# Altium project pcb-sensor-AD5933_2.PrjPcb
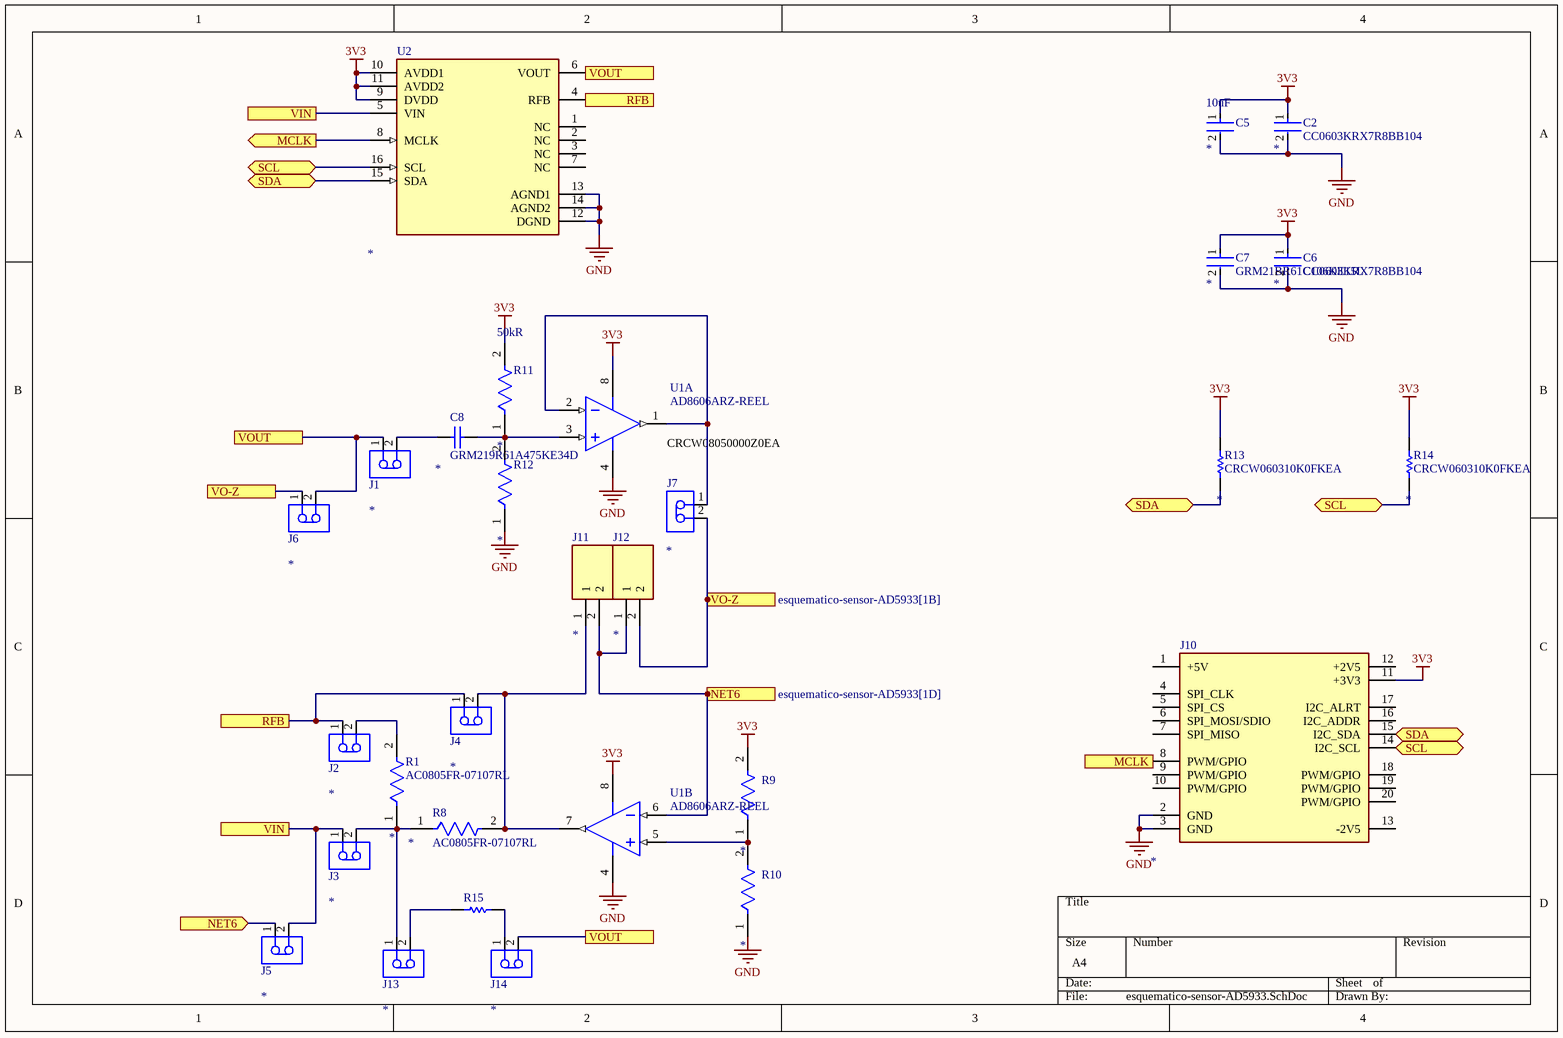
[diagram p0: esquematico-sensor-AD5933.SchDoc]
1 sheet, 28 parts. Net scope: flat (ports and power ports of the same name join across sheets).
Board file: pcb-sensor-AD5933.PcbDoc

## Sheet esquematico-sensor-AD5933.SchDoc
size A4; SheetNumber: 1; SheetTotal: 1

### Parts
C2  CC0603KRX7R8BB104  [FP-CC0603-DA-MFG]
C5  Capacitance: 10uF  [FP-GRM21B-0_1-IPC_C]  (hidden comment: GRM21BR61C106KE15L)
C6  CC0603KRX7R8BB104  [FP-CC0603-DA-MFG]
C7  GRM21BR61C106KE15L  [FP-GRM21B-0_1-IPC_C]
C8  GRM219R61A475KE34D  [CAPC2013X95X45LL10T25]
J1  (no value)  [TECO-640456-2_V]
J2  (no value)  [TECO-640456-2_V]
J3  (no value)  [TECO-640456-2_V]
J4  (no value)  [TECO-640456-2_V]
J5  (no value)  [TECO-640456-2_V]
J6  (no value)  [TECO-640456-2_V]
J7  (no value)  [TECO-640456-2_V]
J10  10129382-920002BLF  [Base Board Modular Connector (MALE)]  (value not drawn)
J11  (no value)  [Terminal Block 2-position]
J12  TB0011-350-02BE  [Terminal Block 2-position]  (value not drawn)
J13  (no value)  [TECO-640456-2_V]
J14  (no value)  [TECO-640456-2_V]
R1  AC0805FR-07107RL  [FP-AC0805-MFG]
R8  AC0805FR-07107RL  [FP-AC0805-MFG]
R9  (no value)  [FP-TNPU0603-e3-MFG]
R10  (no value)  [FP-TNPU0603-e3-MFG]
R11  Resistance: 50kR  [FP-TNPU0603-e3-MFG]
R12  (no value)  [FP-TNPU0603-e3-MFG]
R13  CRCW060310K0FKEA  [RESC1609X50X30NL8T20]
R14  CRCW060310K0FKEA  [RESC1609X50X30NL8T20]
R15  CRCW08050000Z0EA  [RESC2013X50X30LL20T20]  (value not drawn)
U1  AD8606ARZ-REEL  [ADI-R-8_L]  (parts A,B of 2)
U2  AD5933WYRSZ-REEL7  [FP-RS-16-IPC_A]  (value not drawn)

### Ports
MCLK (in, see esquematico-sensor-AD5933[1A]), MCLK (out, see esquematico-sensor-AD5933[3C]), NET6 (in, see esquematico-sensor-AD5933[2C]), NET6 (out, see esquematico-sensor-AD5933[1D]), RFB (see esquematico-sensor-AD5933[1C]), RFB (see esquematico-sensor-AD5933[2A]), SCL (bidir, see esquematico-sensor-AD5933[1A], esquematico-sensor-AD5933[4B]), SCL (bidir, see esquematico-sensor-AD5933[1A], esquematico-sensor-AD5933[4C]), SCL (bidir, see esquematico-sensor-AD5933[4B], esquematico-sensor-AD5933[4C]), SDA (bidir, see esquematico-sensor-AD5933[1A], esquematico-sensor-AD5933[3B]), SDA (bidir, see esquematico-sensor-AD5933[1A], esquematico-sensor-AD5933[4C]), SDA (bidir, see esquematico-sensor-AD5933[3B], esquematico-sensor-AD5933[4C]), VIN (see esquematico-sensor-AD5933[1A]), VIN (see esquematico-sensor-AD5933[1D]), VO-Z (see esquematico-sensor-AD5933[1B]), VO-Z (see esquematico-sensor-AD5933[2C]), VOUT (see esquematico-sensor-AD5933[1B], esquematico-sensor-AD5933[2A]), VOUT (see esquematico-sensor-AD5933[1B], esquematico-sensor-AD5933[2D]), VOUT (see esquematico-sensor-AD5933[2A], esquematico-sensor-AD5933[2D])

### Nets
3V3: C2.1 C5.1 C6.1 C7.1 J10.11(+3V3) R9.2 R11.2 R13.1 R14.2 U1.8(+V) U2.9(DVDD) U2.10(AVDD1) U2.11(AVDD2)
GND: C2.2 C5.2 C6.2 C7.2 J10.2(GND) J10.3(GND) R10.1 R12.1 U1.4(-V) U2.12(DGND) U2.13(AGND1) U2.14(AGND2)
NetC8_1: C8.1 J1.2
NetC8_2: C8.2 R11.1 R12.2 U1.3(+IN_A)
NetJ1_1: J1.1 J6.2 J14.2 U2.6(VOUT) ; port VOUT
NetJ2_1: J2.1 J4.1 U2.4(RFB) ; port RFB
NetJ2_2: J2.2 R1.2
NetJ3_1: J3.1 J5.2 U2.5(VIN) ; port VIN
NetJ3_2: J3.2 J13.1 R1.1 R8.1
NetJ4_2: J4.2 J11.1 R8.2 U1.7(OUT_B)
NetJ5_1: J5.1 J11.2 J12.1 U1.6(-IN_B) ; port NET6
NetJ6_1: J6.1 J7.2 J12.2 ; port VO-Z
NetJ7_1: J7.1 U1.1(OUT_A) U1.2(-IN_A)
NetJ10_8: J10.8(PWM/GPIO) U2.8(MCLK) ; port MCLK
NetJ10_14: J10.14(I2C_SCL) R14.1 U2.16(SCL) ; port SCL
NetJ10_15: J10.15(I2C_SDA) R13.2 U2.15(SDA) ; port SDA
NetJ13_2: J13.2 R15.1
NetJ14_1: J14.1 R15.2
NetR9_1: R9.1 R10.2 U1.5(+IN_B)

Not connected (* = marked no-connect by the designer): J10 1(+5V) 4(SPI_CLK) 5(SPI_CS) 6(SPI_MOSI/SDIO) 7(SPI_MISO) 9(PWM/GPIO) 10(PWM/GPIO) 12(+2V5) 13(-2V5) 16(I2C_ADDR) 17(I2C_ALRT) 18(PWM/GPIO) 19(PWM/GPIO) 20(PWM/GPIO); U2 1(NC) 2(NC) 3(NC) 7(NC)

### Notes on the sheet
- (near U1) CRCW08050000Z0EA

### Library data of the parts
C2 C6 = CMP-03422-000234-1: CAP CER 0.1UF 25V X7R 0603; Manufacturer: YAGEO; Capacitance: 100 nF; Tolerance: 0.1; Temperature Coefficient: 15%; Material: Ceramic; Value: 100 nF; Category: Cap; ComponentLink2URL: http://www.yageo.com/documents/recent/UPY-GPHC_X7R_6.3V-to-50V_18.pdf; Voltage Rating: 25 V; ComponentLink2Description: Datasheet; RoHS: TRUE; Octopart: https://octopart.com/cc0603krx7r8bb104-yageo-8376534; Manufacturer Part Number: CC0603KRX7R8BB104; Mouser Description: CC Series 0603 0.1 uF 25 V ±10% Tolerance X7R SMT Multilayer Ceramic Capacitor; Device Class L2: Capacitors; Automotive: No; Temperature Range Low: -55°C; Lead Free: Yes; Temperature Range High: +125°C; Package: CC0603-DA; Temperature: -55°C to +125°C; Footprint Url: http://www.yageo.com/exep/pages/download/literatures/UPY-C_GEN_24.pdf; Height: 0.9mm; Voltage: 25 V; Temperature Characteristic: X7R; Device Class L3: Ceramic Capacitors; Digikey Description: CAP CER 0.1UF 25V X7R 0603; Device Class L1: Passive Components; Parameter 1: *
C5 C7 = CMP-2007-03453-2: Chip Multilayer Ceramic Capacitors for General Purpose, 0805, 10uF, X5R, 15%, 10%, 16V; Radiation Hardening: No; Thickness: 0.053inch; Voltage Rating (DC): 16V; Lead Free: Lead Free; Package Quantity: 1; Width: 1.25mm; Case Code (Imperial): 0805; Depth: 1.25mm; Packaging: Tape and Reel; Dielectric: X5R; Max Operating Temperature: 85°C; Tolerance: 10%; Voltage Rating: 16V; Voltage: 16V; Height: 1.25mm; Case Code (Metric): 2012; Material: Ceramic; Mount: Surface Mount; Case/Package: 0805; REACH SVHC: No SVHC; Length: 2mm; Min Operating Temperature: -55°C; Termination: SMD/SMT; Parameter 1: *
  C7: Capacitance: 10uF
C8 = CMP-2007-00178-1: Manufacturer: Murata; Part Number: GRM219R61A475KE34D; Parameter 1: *
J1-J7 J13 J14 = CMP-2000-05417-1: Male Header, Pitch 2.54 mm, 1 x 2 Position, Height 10.49 mm, Tail Length 3.556 mm, -55 to 105 degC, RoHS, Bulk; Manufacturer: TE Connectivity; Standards: RoHSCompliant,ELVCompliant,UL94V-0; Material, Housing: Polyester; Agency Approvals: CSA,UL; Brand/Series: MTA-100Series; Contact Centerline Spacing: 0.100 / in.; Material, Contact: CopperAlloy; Current, Rating: 5 / A; Color, Housing: White; Contact Termination Area Plating: Tin; Special Features: Pinstrip; Number of Positions: 2; Pin Spacing: 0.1 / "; Temperature, Operating: -55to+105 / degC; Angle: Straight; Mount Angle: Vertical; Connector Type: MTA-100; Primary Type: InterconnectSystem; Voltage, Rating: 250 / V; Mounting Hole Size: 0.04 / "; Number of Rows: 1; Termination: Solder; Length, Terminal Post: 0.14 / in.; Manufacturer URL: http://www.te.com/; Color: White; Size, Post: 0.025 / in.; Contact Shape: Square; Mounting Type: PCMount; Datasheet URL: https://datasheet.ciiva.com/11746/0900766b80eb7fdd-11746365.pdf; Type: PCBPlug; Datasheet Version: Rev. W, 06/2004; Number of Contacts: 2; Flammability Rating: UL94V-0; Contact Plating: Tin; Length, Pin: 0.14 / "; Contact Mating Area Plating: Tin; Length, Overall: 0.2 / "; Parameter 1: *
J10 = Base Board Modular Connector (MALE): Parameter 1: *
J11 J12 = TB0011-350-02BE: Fixed Terminal Blocks 2 Poles, Screw Type, Horizontal, 3.50 Pitch, 24-18 (AWG), Blue, Terminal Block Connector; Supplier 1: DigiKey; Supplier Part Number 1: 2223-TB0011-350-02BE-ND; Supplier 2: Mouser; Supplier Part Number 2: 179-TB0011-350-02BE; Supplier 3: Farnell; Supplier Part Number 3: TB0011-350-02BE; Parameter 1: *
R1 R8 = CMP-03412-037308-1: Res SMD 107 Ohm 1% 1/8W 0805; Manufacturer: Yageo; Tolerance: 0.01; Value: 107Ω; Automotive Grade: Grade 0; Voltage Rating: 150V; Height: 0.6mm; Device Class L2: Resistors; ComponentLink2Description: Datasheet; Series: AC; Octopart: https://octopart.com/ac0805fr-07107rl-yageo-71367522; Digikey Description: Res SMD 107 Ohm 1% 1/8W 0805; Composition: Thick Film; ComponentLink2URL: http://www.yageo.com/documents/recent/PYu-AC_51_RoHS_L_6.pdf; Ipc Land Pattern Name: RESC200125X50; Category: Res; Temperature Range High: +155°C; Automotive: Yes; Manufacturer Part Number: AC0805FR-07107RL; Footprint Url: http://www.yageo.com/exep/pages/download/literatures/PYu-R_Mount_10.pdf; Device Class L1: Passive Components; RoHS: TRUE; Lead Free: Yes; Resistance: 107Ω; Temperature: -55°C to +155°C; Device Class L3: Chip SMD Resistors; Power Rating: 1/8W; Temperature Range Low: -55°C; Package: AC0805; Parameter 1: *
R9 R10 R12 = CMP-02407-013067-1: RES SMD 50K OHM 0.02% 1/10W 0603; Temperature Coefficient: 5ppm/°C; Max Power Dissipation: 100mW; Resistance: 50kR; Max Operating Temperature: 125°C; Min Operating Temperature: -55°C; Case Code (Metric): 1608; Features: Moisture Resistant; Resistor Type: Thin Film; Packaging: Cut Tape; Case/Package: 0603; Tolerance: 0.02%; Number of Terminations: 2; Case Code (Imperial): 0603; Parameter 1: *
R11 = CMP-02407-013067-1: RES SMD 50K OHM 0.02% 1/10W 0603; Temperature Coefficient: 5ppm/°C; Max Power Dissipation: 100mW; Max Operating Temperature: 125°C; Min Operating Temperature: -55°C; Case Code (Metric): 1608; Features: Moisture Resistant; Resistor Type: Thin Film; Packaging: Cut Tape; Case/Package: 0603; Tolerance: 0.02%; Number of Terminations: 2; Case Code (Imperial): 0603; Parameter 1: *
R13 R14 = CMP-1666-00005-4: Chip Resistor, 10 KOhm, +/- 1%, 100 mW, -55 to 155 degC, 0603 (1608 Metric), RoHS, Tape and Reel; Manufacturer: Vishay Semiconductor; Voltage Rating: 75 V; Max Operating Temperature: 155 degC; PackageDescription: 2-Pin Surface Mount Device, Body 1.575 x 0.85 mm; ComponentLink1Description: Manufacturer URL; RoHSCompliant: true; PackageReference: 0603; REACH SVHC: Unknown; Length: 1.55 mm; DatasheetVersion: 06/2012; Packaging: Tape and Reel; Min Operating Temperature: -55 degC; Mounting Technology: Surface Mount; ComponentLink2URL: https://datasheet.ciiva.com/11809/0900766b80d98afc-11809037.pdf; Height: 0.45 mm; ComponentLink2Description: Datasheet; Package Quantity: 5000; ComponentLink1URL: http://www.vishay.com/; Parameter 1: *
R15 = CMP-2001-04896-1: Manufacturer: Vishay Dale; Part Number: CRCW08050000Z0EA
U1 = CMP-0384-01320-2: Double Channel Wide Bandwidth Operational Amplifier, 10 MHz BW, 5 V/us SR, Industrial, 8-pin SOIC (R-8), Reel; Generic Part Number: AD8606; Manufacturer: Analog Devices; Amplifiers Per Package: 2; Input Bias Current: 200fA; V Span Max: 6V; V Span Min: 2.7V; Input Offset Voltage: 20uV; Small Signal Bandwidth: 10MHz; Slew Rate: 5V/us; Iq/Amp: 1.2mA; ComponentLink4URL: http://www.analog.com/en/all-operational-amplifiers-op-amps/operational-amplifiers-op-amps/ad8606/products/product.html#product-recommendations; ComponentLink3URL: http://www.analog.com/static/imported-files/packages/PKG_PDF/SOIC_Narrow%20(R)/R_8.pdf; PackageDescription: 8-Pin Standard Small Outline Package, Body 3.9 x 4.9 mm, Pitch 1.27 mm; DatasheetVersion: Rev. L; ComponentLink4Description: Reference Circuit; Code_JEDEC: MS-012-AA; PartNumber: AD8606ARZ-REEL; PackageVersion: 060506-A; ComponentLink1Description: Manufacturer URL; RevisionNote: Reference Circuit URL fixed; PackageReference: R-8; ComponentLink2Description: Datasheet; Mounting Technology: Surface Mount; ComponentLink1URL: http://www.analog.com/en/index.html; ComponentLink2URL: http://www.analog.com/static/imported-files/data_sheets/AD8605_8606_8608.pdf; ComponentLink3Description: Package Specification
U2 = CMP-09111-000002-1: 12BIT 1 MSPS, IMPEDANCE CONVERTE; Sampling Rate: 1MS/s; Nominal Supply Current: 15mA; Resolution: 12b; Frequency: 16.776MHz; Accuracy: 0.5%; Lead Free: Contains Lead; Operating Supply Current: 15mA; RoHS Compliant: Yes; Number of Pins: 16; Parameter 1: *